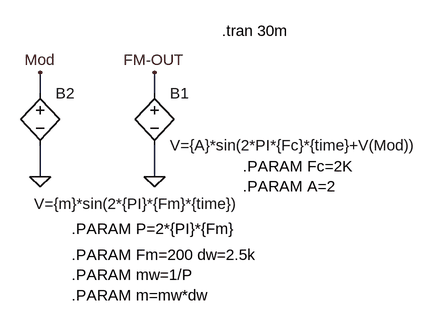
[diagram p0: schematic Fig_2-162_FM_Theoretic.asc]
Fig_2-162_FM_Theoretic.asc, the LTspice schematic file:
Version 4
SHEET 1 880 680
WIRE 80 144 80 112
WIRE 256 144 256 112
WIRE 80 272 80 224
WIRE 256 272 256 224
FLAG 80 272 0
FLAG 256 272 0
FLAG 80 112 Mod
FLAG 256 112 FM-OUT
SYMBOL bv 256 128 R0
SYMATTR InstName B1
SYMATTR Value V={A}*sin(2*PI*{Fc}*{time}+V(Mod))
SYMBOL bv 80 128 R0
WINDOW 3 -9 186 Left 2
SYMATTR Value V={m}*sin(2*{PI}*{Fm}*{time})
SYMATTR InstName B2
TEXT 128 392 Left 2 !.PARAM Fm=200 dw=2.5k\n.PARAM mw=1/P\n.PARAM m=mw*dw
TEXT 392 256 Left 2 !.PARAM Fc=2K\n.PARAM A=2
TEXT 360 48 Left 2 !.tran 30m
TEXT 128 352 Left 2 !.PARAM P=2*{PI}*{Fm}

The netlist it stands for:
* Fig_2-162_FM_Theoretic.asc
B1 FM-OUT 0 V={A}*sin(2*PI*{Fc}*{time}+V(Mod))
B2 Mod 0 V={m}*sin(2*{PI}*{Fm}*{time})
.PARAM Fm=200 dw=2.5k
.PARAM mw=1/P
.PARAM m=mw*dw
.PARAM Fc=2K
.PARAM A=2
.tran 30m
.PARAM P=2*{PI}*{Fm}
.backanno
.end